# EAGLE design timer3 (EAGLE 5.07)
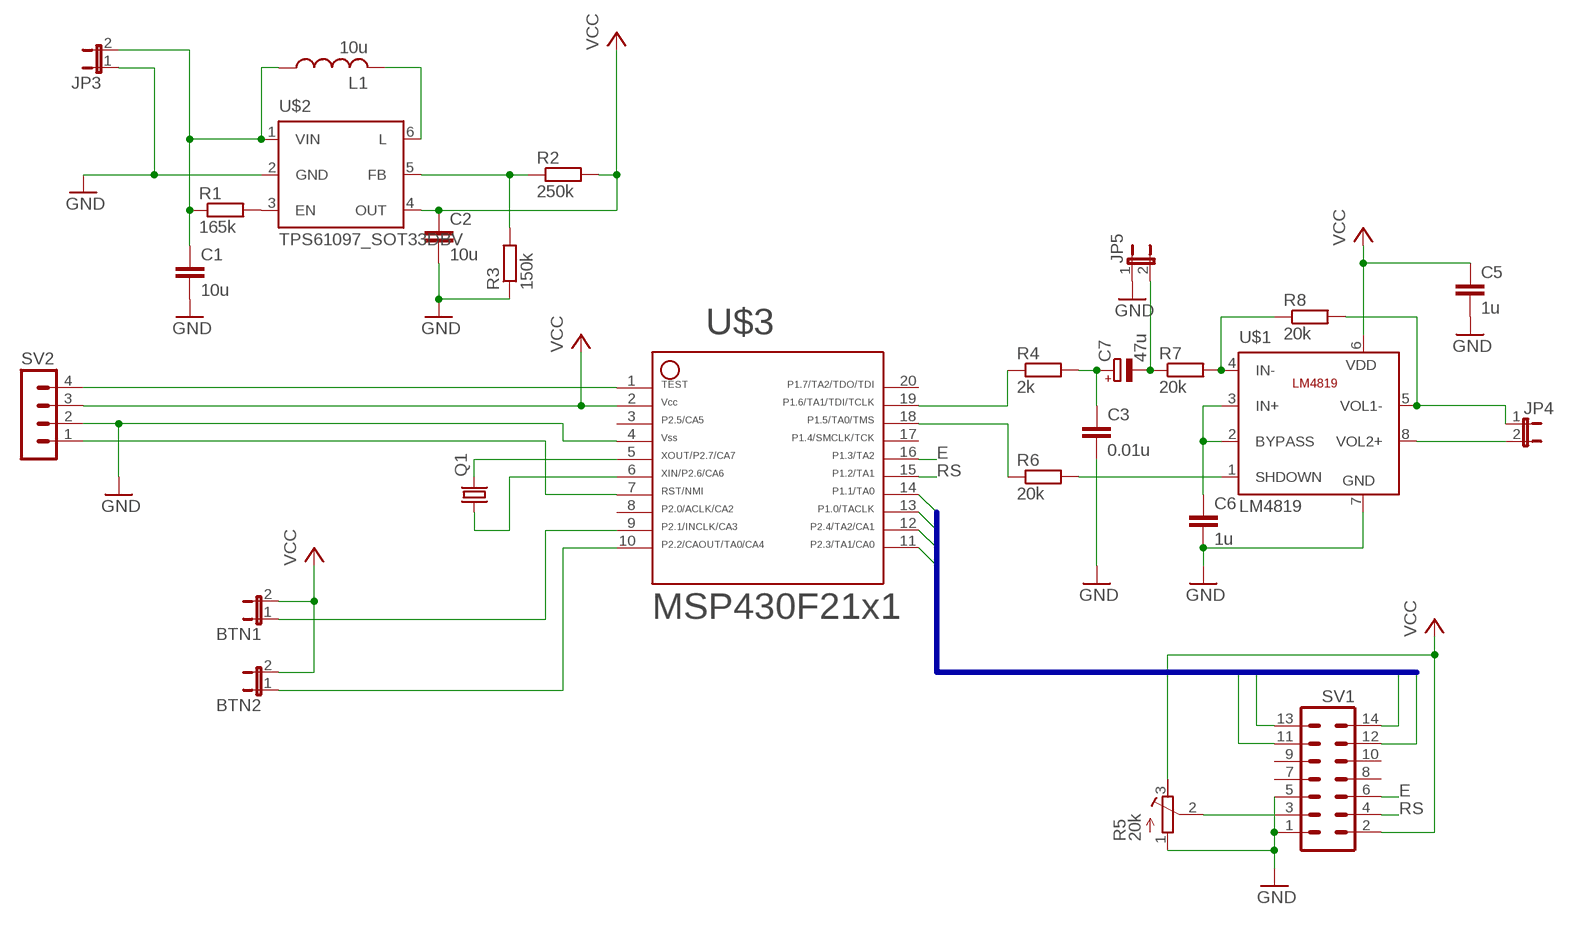
[diagram p0: schematic, sheet 1]

## Parts
BTN1  JP1E  [JP1]
BTN2  JP1E  [JP1]
C1  10u  C-EUC0603  [C0603]
C2  10u  C-EUC0603  [C0603]
C3  0.01u  C-EU025-025X050  [C025-025X050]
C5  1u  C-EU025-025X050  [C025-025X050]
C6  1u  C-EU025-025X050  [C025-025X050]
C7  47u  CPOL-EUE2.5-5  [E2,5-5]
JP3  JP1E  [JP1]
JP4  JP1E  [JP1]
JP5  JP1E  [JP1]
L1  10u  L-US0204/5  [0204/5]
Q1  CRYSTALTC38H  [TC38H]
R1  165k  R-EU_0204/7  [0204/7]
R2  250k  R-EU_0204/7  [0204/7]
R3  150k  R-EU_0204/7  [0204/7]
R4  2k  R-EU_0204/7  [0204/7]
R5  20k  R-TRIMM3339P  [RTRIM3339P]
R6  20k  R-EU_0204/7  [0204/7]
R7  20k  R-EU_0204/7  [0204/7]
R8  20k  R-EU_0204/7  [0204/7]
SV1  MA07-2  [MA07-2]
SV2  MA04-1  [MA04-1]
U$1  LM4819  [SO08]
U$2  TPS61097_SOT33DBV  [SOT33DBV]
U$3  F21X1---DW20  [DW20]

## Nets
DB4: SV1.11 U$3.14
DB5: SV1.12 U$3.13
DB6: SV1.13 U$3.12
DB7: SV1.14 U$3.11
E: SV1.6 U$3.16
GND: C1.2 C2.2 C3.2 C5.2 C6.2 JP3.1 JP5.1 R3.1 R5.1(E) SV1.1 SV1.5 SV2.2 U$1.7(GND) U$2.2(GND) U$3.4
N$1: C1.1 JP3.2 L1.1 R1.1 U$2.1(VIN)
N$2: R1.2 U$2.3(EN)
N$3: L1.2 U$2.6(L)
N$4: SV2.4 U$3.1
N$5: R2.1 R3.2 U$2.5(FB)
N$6: C3.1 C7.+ R4.2
N$8: R4.1 U$3.19
N$9: Q1.2 U$3.5
N$10: Q1.1 U$3.6
N$11: C7.- JP5.2 R7.1
N$12: BTN1.1 U$3.9
N$13: BTN2.1 U$3.10
N$14: R6.1 U$3.18
N$15: R6.2 U$1.1(SHDOWN)
N$16: R5.2(S) SV1.3
N$17: C6.1 U$1.2(BYPASS) U$1.3(IN+)
N$18: R7.2 R8.1 U$1.4(IN-)
N$19: JP4.1 R8.2 U$1.5(VOL1-)
N$20: JP4.2 U$1.8(VOL2+)
N$21: SV2.1 U$3.7
OUT: C2.1 R2.2 U$2.4(OUT) ; supply symbol labelled VCC
RS: SV1.4 U$3.15
VCC: BTN1.2 BTN2.2 C5.1 R5.3(A) SV1.2 SV2.3 U$1.6(VDD) U$3.2
Unconnected: SV1.7 SV1.8 SV1.9 SV1.10 U$3.3 U$3.8 U$3.17 U$3.20

## Buses
DB[4..7]

## Library data of the parts
BTN1 BTN2 JP3-JP5 = jumper:JP1E: JUMPER
C1-C3 C5 C6 = resistor:C-EU: CAPACITOR, European symbol
C7 = rcl:CPOL-EU: POLARIZED CAPACITOR, European symbol
L1 = resistor:L-US: INDUCTOR, American symbol
Q1 = crystal:CRYSTAL: CRYSTAL
R1-R4 R6-R8 = resistor:R-EU_: RESISTOR, European symbol
R5 = resistor:R-TRIMM: Trimm resistor
SV1 = con-lstb:MA07-2: PIN HEADER
SV2 = con-lstb:MA04-1: PIN HEADER
U$1 = mbonnin:LM4819: audio amplifier with shutdown
U$2 = mbonnin:TPS61097_SOT33DBV
U$3 = TI_MSP430_v15:F21X1---DW20: *** MSP430F21x1 *** DW20

## Board
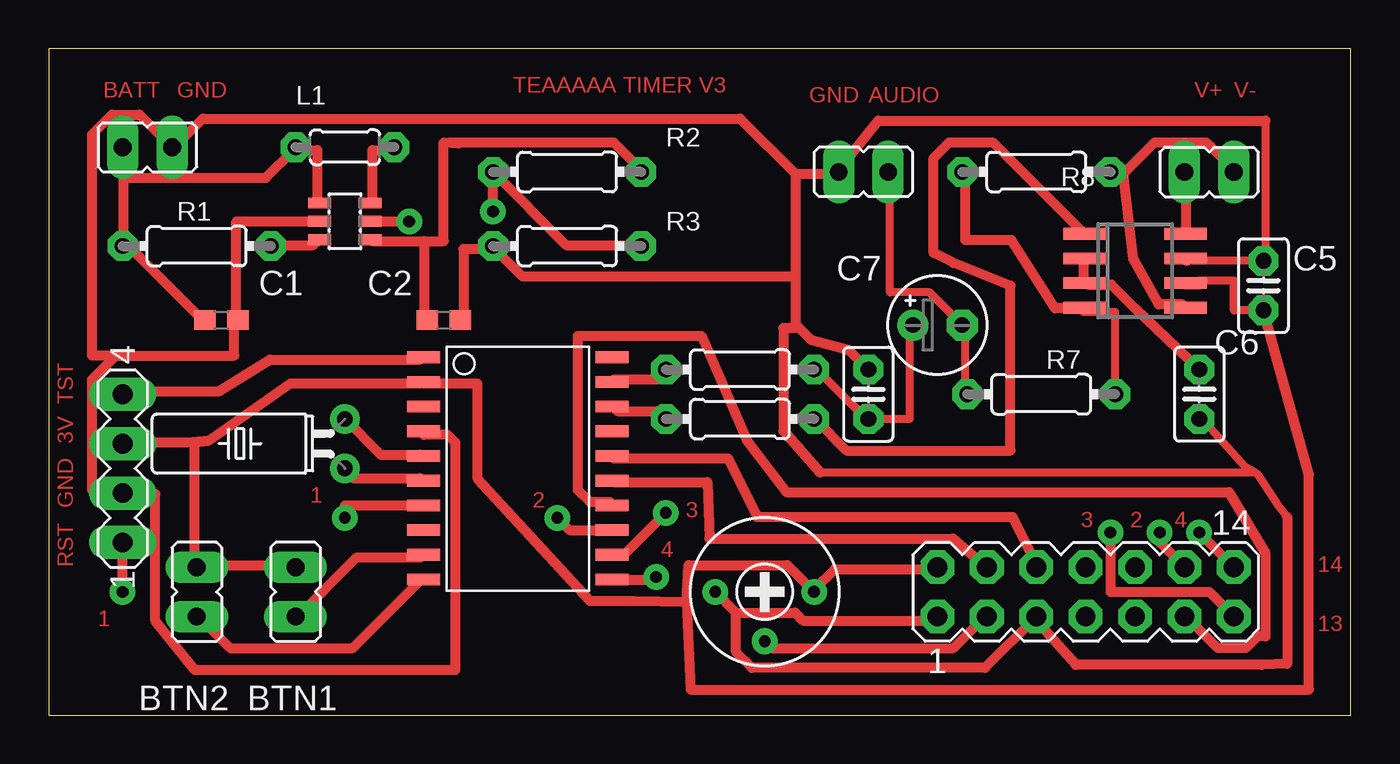
[diagram p1: board, top side]
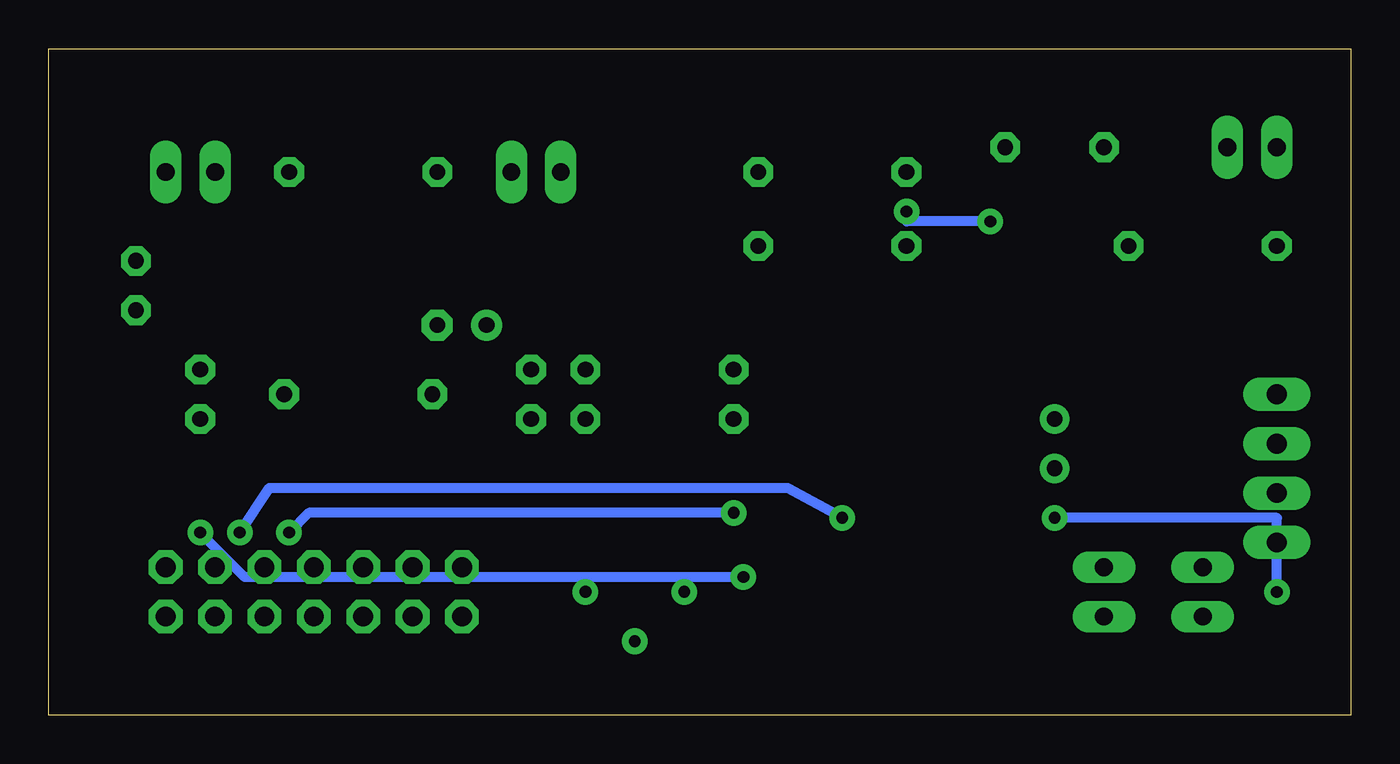
[diagram p2: board, bottom side, seen from below]

Size 66.98 x 34.28 mm. Coordinates in mm from the lower left corner, seen from the top.
Outline: 0,0 66.98,0 66.98,34.28 0,34.28 0,0
Copper layers (1*16): Top 0.035mm / dielectric 1.5mm / Bottom 0.035mm
Design rules "martin *": minimum track width 16mil, minimum drill 16mil, track to track 8mil, track to pad 20mil, pad to pad 8mil, via to via 8mil, smd to smd 8mil, copper to edge 8mil, drill to drill 8mil, minimum pad ring 14mil, minimum via ring 14mil, stop-mask expansion 4mil, vias tented up to drill 0mil, thermal gap 10mil

### Footprints (pad centres in the part's own frame; a part is rotated, then mirrored left to right if it is on the bottom)
JP1 = drill 0.914 long: 1 0,-1.27; 2 0,1.27
C0603 = smd 1.1 x 1: 1 -0.85,0; 2 0.85,0
C025-025X050 = drill 0.813 octagon: 1 -1.27,0; 2 1.27,0
E2,5-5 = drill 0.813 pad 1.6 round: + -1.27,0 | drill 0.813 pad 1.6 octagon: - 1.27,0
0204/5 = drill 0.813 octagon: 1 -2.54,0; 2 2.54,0
TC38H = drill 0.813 round: 1 -1.27,0; 2 1.27,0
0204/7 = drill 0.813 octagon: 1 -3.81,0; 2 3.81,0
RTRIM3339P = drill 0.61 round: 1 -2.54,0; 2 0,-2.54; 3 2.54,0
MA07-2 = drill 1.016 octagon: 1 -7.62,-1.27; 2 -7.62,1.27; 3 -5.08,-1.27; 4 -5.08,1.27; 5 -2.54,-1.27; 6 -2.54,1.27; 7 0,-1.27; 8 0,1.27; 9 2.54,-1.27; 10 2.54,1.27; 11 5.08,-1.27; 12 5.08,1.27; 13 7.62,-1.27; 14 7.62,1.27
MA04-1 = drill 1.016 long: 1 -3.81,0; 2 -1.27,0; 3 1.27,0; 4 3.81,0
SO08 = smd 0.6 x 2.2: 1 -1.905,-2.6; 2 -0.635,-2.6; 3 0.635,-2.6; 4 1.905,-2.6; 5 1.905,2.6; 6 0.635,2.6; 7 -0.635,2.6; 8 -1.905,2.6
SOT33DBV = smd 0.55 x 1.2: 1 -0.95,-1.3; 2 0,-1.3; 3 0.95,-1.3; 4 0.95,1.3; 5 0,1.3; 6 -0.95,1.3
DW20 = smd 0.6 x 1.7: 1 -5.715,-4.85; 2 -4.445,-4.85; 3 -3.175,-4.85; 4 -1.905,-4.85; 5 -0.635,-4.85; 6 0.635,-4.85; 7 1.905,-4.85; 8 3.175,-4.85; 9 4.445,-4.85; 10 5.715,-4.85; 11 5.715,4.85; 12 4.445,4.85; 13 3.175,4.85; 14 1.905,4.85; 15 0.635,4.85; 16 -0.635,4.85; 17 -1.905,4.85; 18 -3.175,4.85; 19 -4.445,4.85; 20 -5.715,4.85

### Placement (x,y rotation side)
BTN1  12.7,6.35 0 top
BTN2  7.62,6.35 0 top
C1  8.89,20.32 0 top
C2  20.32,20.32 0 top
C3  42.16,16.51 90 top
C5  62.48,22.1 90 top
C6  59.18,16.51 270 top
C7  45.72,20.07 0 top
JP3  5.08,29.21 90 top
JP4  59.69,27.94 90 top
JP5  41.91,27.94 270 top
L1  15.24,29.21 0 top
Q1  15.24,13.97 90 top
R1  7.62,24.13 0 top
R2  26.67,27.94 0 top
R3  26.67,24.13 0 top
R4  35.56,17.78 0 top
R5  36.83,6.35 0 top
R6  35.56,15.24 0 top
R7  51.05,16.51 0 top
R8  50.8,27.94 0 top
SV1  53.34,6.35 0 top
SV2  3.81,12.7 90 top
U$1  55.88,22.86 270 top
U$2  15.24,25.4 270 top
U$3  24.13,12.7 270 top

### Tracks (layer width: path | path; a pad name or v marks a point on that pad's centre or on a via)
DB4
  Top 0.508: U$3.14 28.85,10.97 27.84,10.97 27.23,11.58 27.23,19.51 33.58,19.51 35.92,14.12 37.95,11.48 60.71,11.48 62.59,8.33 62.59,4.06 62.18,4.06 61.57,3.45 60.15,3.45 58.52,5.08 SV1.11
DB5  (via drill 0.6)
  Top 0.508: U$3.13 26.8,9.53 v26.16,10.16 | v57.15,9.4 57.15,8.89 SV1.12
  Bottom 0.508: v26.16,10.16 28.96,11.68 55.63,11.68 v57.15,9.4
DB6  (via drill 0.6)
  Top 0.508: U$3.12 29.59,8.26 v31.75,10.41 | v54.61,9.4 54.61,6.35 59.69,6.35 SV1.13
  Bottom 0.508: v31.75,10.41 53.59,10.41 v54.61,9.4
DB7  (via drill 0.6)
  Top 0.508: U$3.11 31.11,6.99 v31.24,7.11 | v59.18,9.4 SV1.14
  Bottom 0.508: v31.24,7.11 56.9,7.11 v59.18,9.4
E
  Top 0.508: U$3.16 29.06,13.21 34.95,13.21 36.42,10.21 49.58,10.21 50.8,7.72 SV1.6
GND
  Top 0.406: 58.52,23.37 C5.2 62.59,23.37 62.59,30.58 | 61.54,12.78 62.13,12.45 63.14,10.92 63.7,10.21 | 61.54,12.78 59.33,15.24 C6.2 | 39.67,12.5 62.05,12.5 61.54,12.78
  Top 0.508: 3.35,18.39 2.23,17.27 2.23,11.58 3.66,11.58 SV2.2 3.86,11.38 5.49,11.38 5.49,4.88 7.52,2.34 20.93,2.34 20.93,14.02 20.52,14.43 19.3,14.43 U$3.4 | 3.35,18.39 3.45,18.49 9.55,18.49 9.55,20.32 C1.2 9.65,20.32 9.65,25.4 U$2.2 | 3.35,18.39 3.25,18.49 2.23,18.49 2.23,29.87 3.25,30.89 4.67,30.89 JP3.1 6.5,29.26 7.92,30.68 35.56,30.68 38.41,27.84 | 35.36,5.28 38.41,5.28 38.81,4.88 45.52,4.88 SV1.1 | 35.36,5.28 R5.1 | 35.36,5.28 35.36,3.25 36.17,2.44 48.16,2.44 SV1.5 50.8,4.88 52.83,2.59 62.38,2.59 63.7,2.64 63.7,10.21 | 58.52,23.37 U$1.7 | C2.2 21.34,20.32 21.34,23.98 22.76,23.98 R3.1 22.96,23.98 24.38,22.55 38.41,22.55 | 38.51,20.02 38.41,20.12 38.41,22.55 | 38.51,20.02 39.22,19.3 41.15,18.8 C3.2 | 38.41,27.84 38.41,22.55 | 38.41,27.84 40.64,27.84 JP5.1 40.64,28.04 42.67,30.58 62.59,30.58 | 39.67,12.5 37.8,14.63 37.8,19.91 38.41,19.91 38.51,20.02
N$1
  Top 0.508: U$2.1 13.82,26.42 13.82,29.06 12.8,29.06 L1.1 12.6,29.06 11.18,27.64 3.86,27.64 | C1.1 7.92,20.32 4.27,23.98 3.86,23.98 R1.1 3.86,24.18 3.86,27.64 | 3.86,27.64 3.86,29.06 JP3.2
N$2
  Top 0.508: U$2.3 13.82,24.38 13.61,24.18 11.58,24.18 R1.2
N$3
  Top 0.508: U$2.6 16.66,26.42 16.66,29.06 17.68,29.06 L1.2
N$4
  Top 0.508: U$3.1 19.1,18.29 11.38,18.29 8.74,16.66 3.86,16.66 SV2.4
N$5  (via drill 0.6)
  Top 0.508: R3.2 30.48,24.18 26.62,24.18 R2.1 v22.86,25.91 | U$2.5 v18.54,25.4
  Bottom 0.508: v18.54,25.4 22.86,25.4 v22.86,25.91
N$6
  Top 0.406: 41.15,16.15 39.62,17.68 39.42,17.68 R4.2 | 41.15,16.15 42.06,15.24 C3.1 | C7.+ 44.3,19.91 44.3,15.24 42.27,15.24 41.15,16.15
N$8
  Top 0.508: U$3.19 29.06,17.27 31.29,17.27 31.7,17.68 R4.1
N$9
  Top 0.508: Q1.2 17.07,13.41 19.1,13.41 U$3.5
N$10
  Top 0.508: U$3.6 19.1,12.19 15.65,12.19 15.24,12.6 Q1.1
N$11
  Top 0.406: R7.1 47.14,16.66 47.14,19.91 C7.- 45.31,21.74 43.28,21.74 43.28,27.84 JP5.2
N$12
  Top 0.508: U$3.9 19.1,8.13 15.85,8.13 12.8,5.08 BTN1.1
N$13
  Top 0.508: U$3.10 19.1,6.91 15.65,3.45 9.35,3.45 7.72,5.08 BTN2.1
N$14
  Top 0.508: U$3.18 29.06,15.85 29.26,15.65 31.29,15.65 31.7,15.24 R6.1
N$15
  Top 0.508: U$1.1 53.24,24.79 48.56,29.46 46.33,29.46 45.52,28.65 45.52,23.77 46.53,23.27 49.48,22.1 49.48,13.61 41.05,13.61 39.42,15.24 R6.2
N$16
  Top 0.508: R5.2 37.19,3.45 46.53,3.45 48.16,5.08 SV1.3
N$17
  Top 0.508: U$1.2 53.24,23.37 53.24,22.35 U$1.3 53.44,22.15 54.66,22.15 55.88,20.93 C6.1
N$18
  Top 0.406: R7.2 54.86,20.73 53.24,20.73 U$1.4
  Top 0.508: 53.24,20.93 U$1.4 53.03,20.93 51.77,20.93 49.53,24.43 47.14,24.43 47.14,27.84 R8.1
N$19
  Top 0.508: 55.27,27.84 55.78,23.47 57.1,21.13 58.32,21.13 U$1.5 | 55.27,27.84 54.66,27.84 R8.2 55.27,27.84 | 55.27,27.84 56.9,29.46 59.54,29.46 60.96,28.04 JP4.1
N$20
  Top 0.508: U$1.8 58.52,24.79 58.52,27.84 JP4.2
N$21  (via drill 0.6)
  Top 0.508: U$3.7 15.24,10.79 v15.24,10.16 | v3.81,6.35 SV2.1
  Bottom 0.508: v15.24,10.16 3.81,10.16 v3.81,6.35
OUT
  Top 0.508: 19.3,24.38 19.3,20.32 C2.1 | 19.3,24.38 16.66,24.38 U$2.4 | 19.3,24.38 20.32,24.38 20.32,29.46 21.08,29.41 20.62,29.46 29.06,29.46 30.48,28.04 R2.2
RS
  Top 0.508: U$3.15 29.06,11.99 33.88,11.99 33.98,9.09 46.53,9.09 SV1.4
VCC
  Top 0.406: C5.1 60.96,20.83 60.96,22.35 59.18,22.35 59.18,22.1 58.48,22.1 U$1.6
  Top 0.508: U$1.6 58.52,22.15 | SV1.2 45.72,7.52 40.44,7.52 39.42,6.5 R5.3 38,7.72 32.92,7.72 32.82,5.84 | BTN1.2 12.6,7.72 7.72,7.72 BTN2.2 7.52,7.72 7.52,14.02 7.32,14.02 8.23,14.12 | 8.23,14.12 7.11,14.02 3.86,14.02 SV2.3 | 8.23,14.12 12.45,17.07 19.1,17.07 U$3.2 19.3,17.07 22.05,17.07 22.05,12.19 27.84,5.89 30.07,5.89 32.82,5.84 | C5.1 64.82,12.39 64.82,1.32 33.02,1.32 32.82,5.84

### Text on the board
Top: BATT | GND | TEAAAAA TIMER V3 | V+ | V- | GND | AUDIO | TST | 3V | GND | 1 | 2 | 3 | 3 | 2 | 4 | RST | 4 | 14 | 1 | 13